# Altium schematic sheet Peripheral.SchDoc
size A4; SheetNumber: 5; SheetTotal: 7
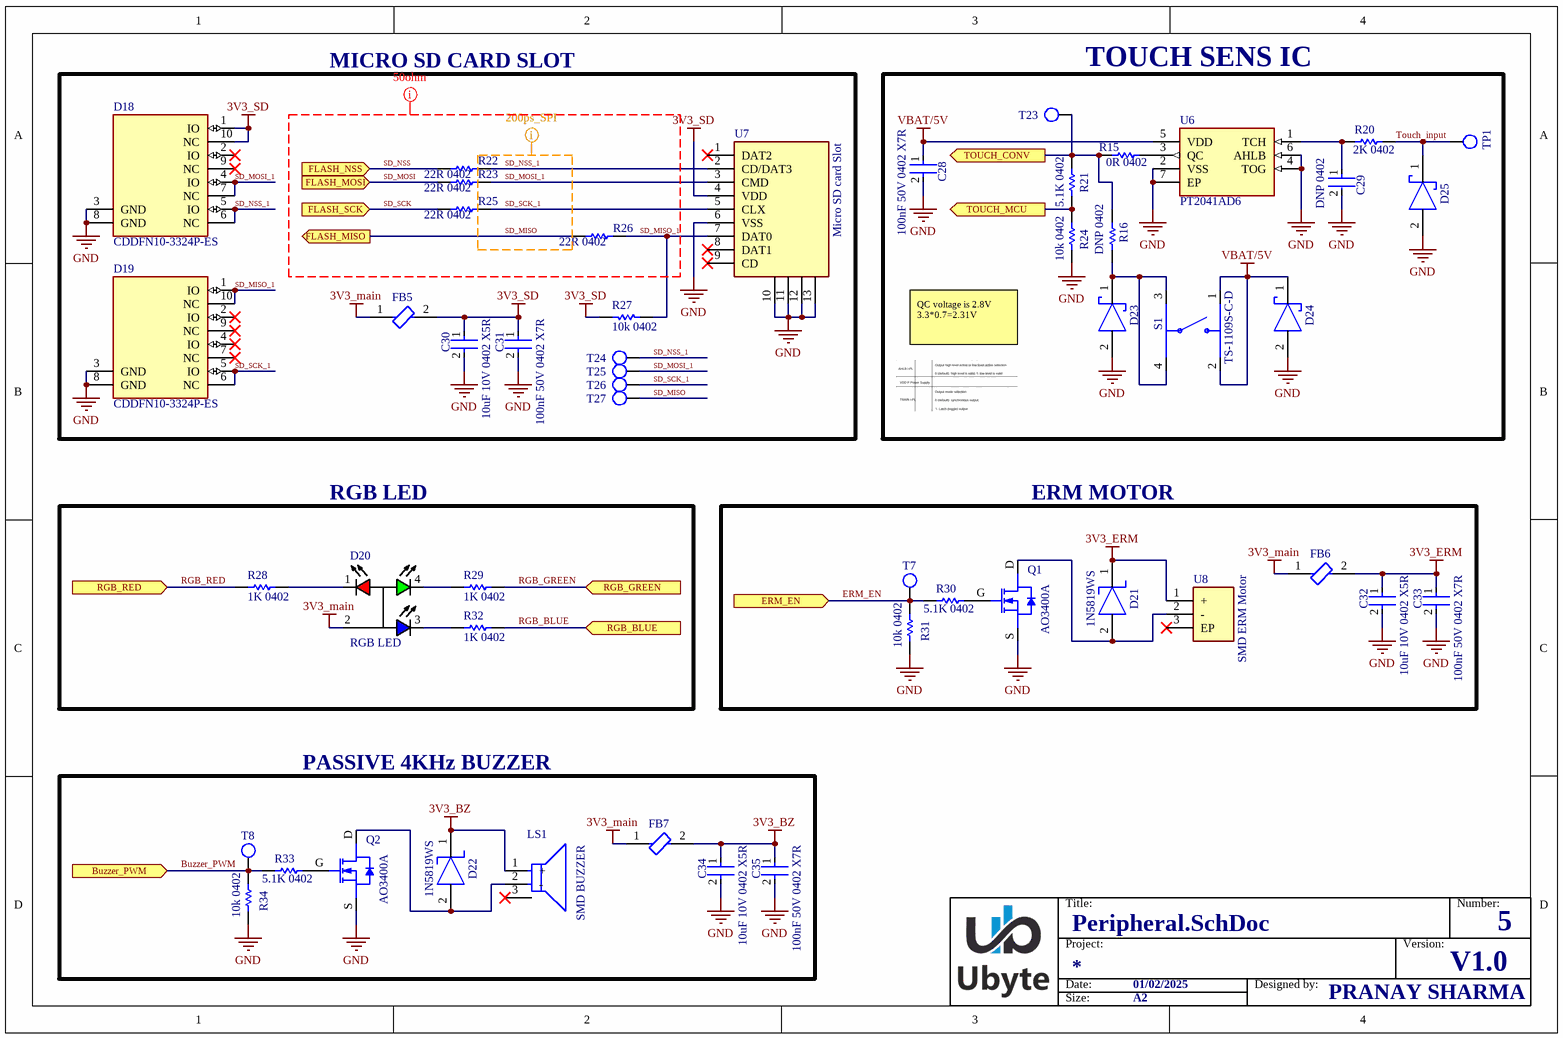
[diagram p0: Peripheral.SchDoc]

## Parts
C28  100nF 50V 0402 X7R  [0402 IPC CLASS C CAPACITOR]
C29  DNP 0402  [0402 IPC Class C Capacitor]  (no BOM)
C30  10uF 10V 0402 X5R  [0402 IPC CLASS C CAPACITOR]
C31  100nF 50V 0402 X7R  [0402 IPC CLASS C CAPACITOR]
C32  10uF 10V 0402 X5R  [0402 IPC CLASS C CAPACITOR]
C33  100nF 50V 0402 X7R  [0402 IPC CLASS C CAPACITOR]
C34  10uF 10V 0402 X5R  [0402 IPC CLASS C CAPACITOR]
C35  100nF 50V 0402 X7R  [0402 IPC CLASS C CAPACITOR]
D18  CDDFN10-3324P-ES  [DFN2510D-10 IPC-C]
D19  CDDFN10-3324P-ES  [DFN2510D-10 IPC-C]
D20  RGB LED  [NH-B1515RGBA-HF IPC-C]
D21  1N5819WS  [SOD-323 IPC-C]
D22  1N5819WS  [SOD-323 IPC-C]
D23  SP3031-01ETG  [SOD882 IPC-C]  (value not drawn)
D24  SP3031-01ETG  [SOD882 IPC-C]  (value not drawn)
D25  SP3031-01ETG  [SOD882 IPC-C]  (value not drawn)
FB5  BLM15AX102SN1D  [0402 IPC CLASS C FERRITE BEAD]  (value not drawn)
FB6  BLM15AX102SN1D  [0402 IPC CLASS C FERRITE BEAD]  (value not drawn)
FB7  BLM15AX102SN1D  [0402 IPC CLASS C FERRITE BEAD]  (value not drawn)
LS1  SMD BUZZER  [MLT-5020]
Q1  AO3400A  [SOT-23 IPC-C]
Q2  AO3400A  [SOT-23 IPC-C]
R15  0R 0402  [0402 IPC CLASS B RESISTOR]
R16  DNP 0402  [0402 IPC CLASS B RESISTOR]  (no BOM)
R20  2K 0402  [0402 IPC CLASS C RESISTOR]
R21  5.1K 0402  [0402 IPC CLASS C RESISTOR]
R22  22R 0402  [0402 IPC CLASS C RESISTOR]
R23  22R 0402  [0402 IPC CLASS C RESISTOR]
R24  10k 0402  [0402 IPC CLASS C RESISTOR]
R25  22R 0402  [0402 IPC CLASS C RESISTOR]
R26  22R 0402  [0402 IPC CLASS C RESISTOR]
R27  10k 0402  [0402 IPC CLASS C RESISTOR]
R28  1K 0402  [0402 IPC CLASS C RESISTOR]
R29  1K 0402  [0402 IPC CLASS C RESISTOR]
R30  5.1K 0402  [0402 IPC CLASS C RESISTOR]
R31  10k 0402  [0402 IPC CLASS C RESISTOR]
R32  1K 0402  [0402 IPC CLASS C RESISTOR]
R33  5.1K 0402  [0402 IPC CLASS C RESISTOR]
R34  10k 0402  [0402 IPC CLASS C RESISTOR]
S1  TS-1109S-C-D  [TS-1127-C]
T7  (no value)  [Test Point TH]  (no BOM)
T8  (no value)  [Test Point TH]  (no BOM)
T23  TP  [Testpoint1]  (value not drawn)  (no BOM)
T24  TP  [Testpoint1]  (value not drawn)  (no BOM)
T25  TP  [Testpoint1]  (value not drawn)  (no BOM)
T26  TP  [Testpoint1]  (value not drawn)  (no BOM)
T27  TP  [Testpoint1]  (value not drawn)  (no BOM)
TP1  Test Point TH  [Test Point TH]  (value not drawn)  (no BOM)
U6  PT2041AD6  [DFN2X2-6L IPC-C]
U7  Micro SD card Slot  [XKTF-015-G]
U8  SMD ERM Motor  [Z3OC1T8219731]

## Blocks framed on the sheet
MICRO SD CARD SLOT: C30 C31 D18 D19 FB5 R22 R23 R25-R27 T24-T27 U7
TOUCH SENS IC: C28 C29 D23-D25 R15 R16 R20 R21 R24 S1 T23 TP1 U6
RGB LED: D20 R28 R29 R32
ERM MOTOR: C32 C33 D21 FB6 Q1 R30 R31 T7 U8
PASSIVE 4KHz BUZZER: C34 C35 D22 FB7 LS1 Q2 R33 R34 T8

## Ports
Buzzer_PWM (in), ERM_EN (in), FLASH_MISO (out), FLASH_MOSI (in), FLASH_NSS (in), FLASH_SCK (in), RGB_BLUE (in), RGB_GREEN (in), RGB_RED (in), TOUCH_CONV (out), TOUCH_MCU (out)

## Nets
3V3_BZ: C34.1 C35.1 D22.1(C) FB7.2 LS1.1(+)
3V3_ERM: C32.1 C33.1 D21.1(C) FB6.2 U8.1(+)
3V3_main: D20.2(COM+) FB5.1 FB6.1 FB7.1
3V3_SD: C30.1 C31.1 D18.1(IO) D18.10(NC) FB5.2 R27.1 U7.4(VDD)
GND: C28.2 C29.2 C30.2 C31.2 C32.2 C33.2 C34.2 C35.2 D18.3(GND) D18.8(GND) D19.3(GND) D19.8(GND) D23.2(A) D24.2(A) D25.2(A) Q1.S(SOURCE) Q2.S(SOURCE) R24.2 R31.1 R34.1 U6.2(VSS) U6.4(TOG) U6.6(AHLB) U6.7(EP) U7.6(VSS) U7.10 U7.11 U7.12 U7.13
VBAT/5V: C28.1 D24.1(C) S1.1 S1.2 U6.5(VDD)
Buzzer_PWM: R33.1 R34.2 T8.0 ; port Buzzer_PWM
ERM_EN: R30.1 R31.2 T7.0 ; port ERM_EN
RGB_BLUE: R32.2 ; port RGB_BLUE
RGB_GREEN: R29.2 ; port RGB_GREEN
RGB_RED: R28.1 ; port RGB_RED
SD_MISO: R26.1 T27.0 ; port FLASH_MISO
SD_MISO_1: D19.1(IO) D19.10(NC) R26.2 R27.2 U7.7(DAT0)
SD_MOSI: R23.1 ; port FLASH_MOSI
SD_MOSI_1: D18.4(IO) D18.7(NC) R23.2 T25.0 U7.3(CMD)
SD_NSS: R22.1 ; port FLASH_NSS
SD_NSS_1: D18.5(IO) D18.6(NC) R22.2 T24.0 U7.2(CD/DAT3)
SD_SCK: R25.1 ; port FLASH_SCK
SD_SCK_1: D19.5(IO) D19.6(NC) R25.2 T26.0 U7.5(CLX)
TOUCH_CONV: R15.2 R16.1 R21.2 T23.0 ; port TOUCH_CONV
Touch_input: D25.1(C) R20.2 TP1.0
TOUCH_MCU: R21.1 R24.1 ; port TOUCH_MCU
NetC29_1: C29.1 R20.1 U6.1(TCH)
NetD20_1: D20.1(R-) R28.2
NetD20_3: D20.3(B-) R32.1
NetD20_4: D20.4(G-) R29.1
NetD21_2: D21.2(A) Q1.D(DRAIN) U8.2(-)
NetD22_2: D22.2(A) LS1.2(-) Q2.D(DRAIN)
NetD23_1: D23.1(C) R16.2 S1.3 S1.4
NetQ1_G: Q1.G(GATE) R30.2
NetQ2_G: Q2.G(GATE) R33.2
NetR15_1: R15.1 U6.3(QC)

Not connected (* = marked no-connect by the designer): D18 2(IO)* 9(NC)*; D19 2(IO)* 4(IO)* 7(NC)* 9(NC)*; LS1 3(A)*; U7 1(DAT2)* 8(DAT1)* 9(CD)*; U8 3(EP)*

## Layout directives
net class 50ps_SDIO: SD_MISO, SD_MOSI_1, SD_NSS_1, SD_SCK_1
net class 50ohm: SD_MISO, SD_MISO_1, SD_MOSI, SD_MOSI_1, SD_NSS, SD_NSS_1, SD_SCK, SD_SCK_1

## Notes on the sheet
- QC voltage is 2.8V
  3.3*0.7=2.31V
- Title:
- Number:
- Date:
- Project:
- 01/02/2025
- Designed by:
- Version:
- V1.0
- Size:
- A2
- PRANAY SHARMA

## Library data of the parts
C29 = Capacitor 0402
D20 = NH-B1515RGBA-HF
LS1 = MLT-5020
R15 R16 = 0R 1% 0402
R20 = 2K 1% 0402
R21 R30 R33 = 5.1K 1% 0402
R22 R23 R25 R26 = 22R 1% 0402
R24 R27 R31 R34 = 10k 1% 0402
R28 R29 R32 = 1K 1% 0402
S1 = TS-1127-C
T7 T8 = Test Point TH
T23-T27 = Testpoint1
U7 = XKTF-015-G
U8 = Z3OC1T8219731